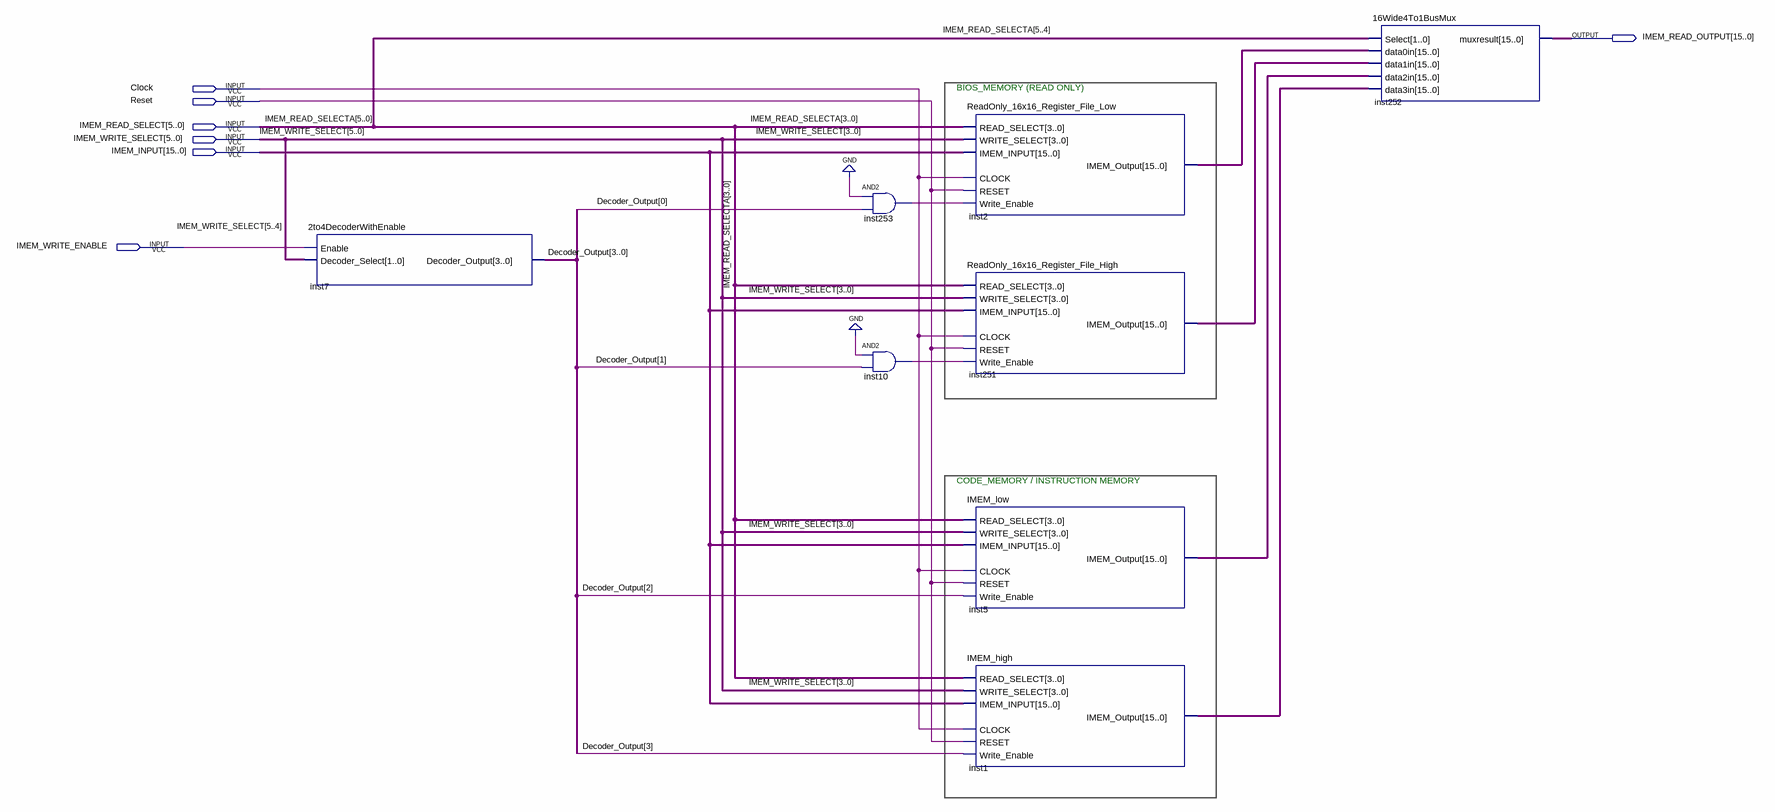
[diagram p0: schematic sheet]
// Quartus schematic IMEM.bdf as structural Verilog: 8 symbols, 7 pins
module IMEM (
  input  Clock,
  input  Reset,
  input  [5:0] IMEM_READ_SELECT,
  input  [5:0] IMEM_WRITE_SELECT,
  input  [15:0] IMEM_INPUT,
  input  IMEM_WRITE_ENABLE,
  output [15:0] IMEM_READ_OUTPUT
);

  wire inst10_out, inst253_out;
  wire [3:0] Decoder_Output;
  wire [15:0] inst1_imem_output, inst2_imem_output, inst5_imem_output, inst251_imem_output;

  \2to4DecoderWithEnable  inst7 (
    .Enable(IMEM_WRITE_ENABLE), .Decoder_Select(IMEM_WRITE_SELECT[5:4]), .Decoder_Output(Decoder_Output));
  and inst253 (inst253_out, 1'b0, Decoder_Output[0]);
  and inst10 (inst10_out, 1'b0, Decoder_Output[1]);
  ReadOnly_16x16_Register_File_Low inst2 (
    .READ_SELECT(IMEM_READ_SELECT[3:0]), .IMEM_INPUT(IMEM_INPUT), .Write_Enable(inst253_out),
    .WRITE_SELECT(IMEM_WRITE_SELECT[3:0]), .CLOCK(Clock), .RESET(Reset), .IMEM_Output(inst2_imem_output));
  ReadOnly_16x16_Register_File_High inst251 (
    .READ_SELECT(IMEM_READ_SELECT[3:0]), .IMEM_INPUT(IMEM_INPUT), .Write_Enable(inst10_out),
    .WRITE_SELECT(IMEM_WRITE_SELECT[3:0]), .CLOCK(Clock), .RESET(Reset), .IMEM_Output(inst251_imem_output));
  IMEM_low inst5 (
    .READ_SELECT(IMEM_READ_SELECT[3:0]), .IMEM_INPUT(IMEM_INPUT), .Write_Enable(Decoder_Output[2]),
    .WRITE_SELECT(IMEM_WRITE_SELECT[3:0]), .CLOCK(Clock), .RESET(Reset), .IMEM_Output(inst5_imem_output));
  IMEM_high inst1 (
    .READ_SELECT(IMEM_READ_SELECT[3:0]), .IMEM_INPUT(IMEM_INPUT), .Write_Enable(Decoder_Output[3]),
    .WRITE_SELECT(IMEM_WRITE_SELECT[3:0]), .CLOCK(Clock), .RESET(Reset), .IMEM_Output(inst1_imem_output));
  \16Wide4To1BusMux  inst252 (
    .data0in(inst2_imem_output), .data1in(inst251_imem_output), .data2in(inst5_imem_output),
    .data3in(inst1_imem_output), .Select(IMEM_READ_SELECT[5:4]), .muxresult(IMEM_READ_OUTPUT));

  // Other names for the same wires on the sheet: IMEM_READ_SELECTA[5:0] = IMEM_READ_SELECT

  // Notes on the sheet:
  //   BIOS_MEMORY (READ ONLY)
  //   CODE_MEMORY / INSTRUCTION MEMORY
endmodule
